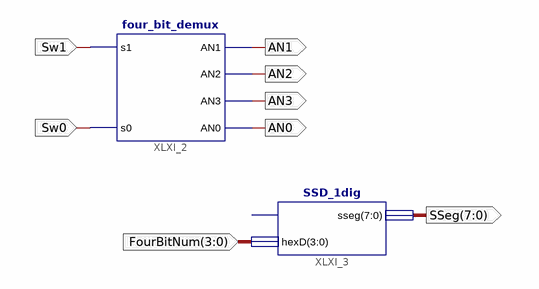
[diagram p0: schematic sheet 1]
// Xilinx ISE schematic Exp6.sch (spartan3e) as structural Verilog: 2 symbols, 8 ports
module Exp6 (
  input  Sw1,
  input  Sw0,
  input  [3:0] FourBitNum,
  output AN1,
  output AN2,
  output AN3,
  output AN0,
  output [7:0] SSeg
);

  four_bit_demux XLXI_2 (.s1(Sw1), .s0(Sw0), .AN3(AN3), .AN0(AN0), .AN1(AN1), .AN2(AN2));
  SSD_1dig XLXI_3 (.hexD(FourBitNum), .sseg(SSeg));  // open: dp_in
endmodule
